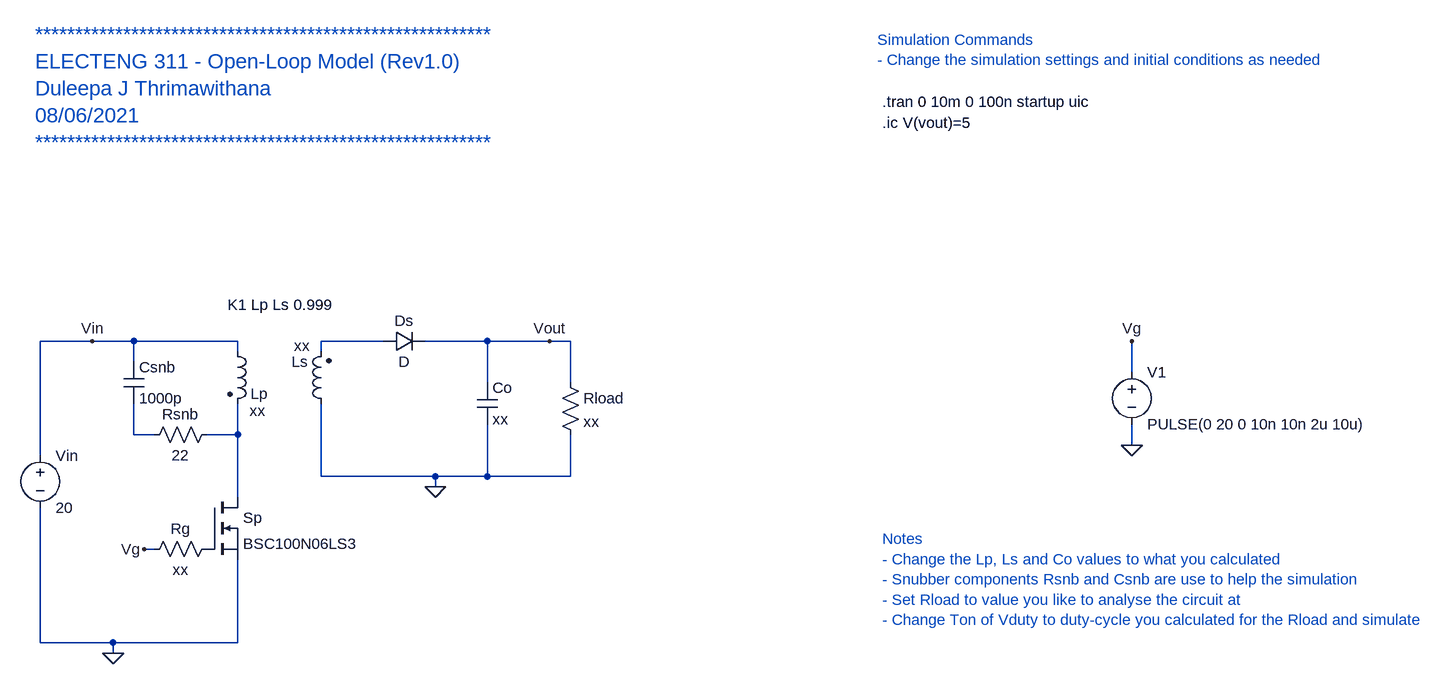
[diagram p0: schematic EE311_OpenLoop.asc]
EE311_OpenLoop.asc, the LTspice schematic file:
Version 4
SHEET 1 2708 1540
WIRE 192 48 112 48
WIRE 256 48 192 48
WIRE 416 48 256 48
WIRE 640 48 544 48
WIRE 800 48 704 48
WIRE 896 48 800 48
WIRE 928 48 896 48
WIRE 416 64 416 48
WIRE 544 64 544 48
WIRE 256 80 256 48
WIRE 1792 96 1792 48
WIRE 800 112 800 48
WIRE 928 112 928 48
WIRE 256 192 256 144
WIRE 288 192 256 192
WIRE 416 192 416 144
WIRE 416 192 368 192
WIRE 1792 208 1792 176
WIRE 112 224 112 48
WIRE 544 256 544 144
WIRE 720 256 544 256
WIRE 800 256 800 176
WIRE 800 256 720 256
WIRE 928 256 928 192
WIRE 928 256 800 256
WIRE 720 272 720 256
WIRE 416 288 416 192
WIRE 288 368 272 368
WIRE 112 512 112 304
WIRE 224 512 112 512
WIRE 416 512 416 384
WIRE 416 512 224 512
WIRE 224 528 224 512
FLAG 224 528 0
FLAG 720 272 0
FLAG 272 368 Vg
FLAG 192 48 Vin
FLAG 896 48 Vout
FLAG 1792 208 0
FLAG 1792 48 Vg
SYMBOL voltage 112 208 R0
SYMATTR InstName Vin
SYMATTR Value 20
SYMBOL ind2 400 48 R0
WINDOW 0 36 81 Left 2
WINDOW 3 34 107 Left 2
SYMATTR InstName Lp
SYMATTR Value xx
SYMATTR Type ind
SYMATTR SpiceLine Rser=0.01
SYMBOL ind2 560 160 R180
WINDOW 0 36 80 Left 2
WINDOW 3 33 105 Left 2
SYMATTR InstName Ls
SYMATTR Value xx
SYMATTR Type ind
SYMATTR SpiceLine Rser=0.01
SYMBOL nmos 368 288 R0
SYMATTR InstName Sp
SYMATTR Value BSC100N06LS3
SYMBOL diode 640 64 R270
WINDOW 0 32 32 VTop 2
WINDOW 3 0 32 VBottom 2
SYMATTR InstName Ds
SYMBOL cap 784 112 R0
SYMATTR InstName Co
SYMATTR Value xx
SYMATTR SpiceLine Rser=10m
SYMBOL res 912 96 R0
SYMATTR InstName Rload
SYMATTR Value xx
SYMBOL res 384 352 R90
WINDOW 0 0 56 VBottom 2
WINDOW 3 32 56 VTop 2
SYMATTR InstName Rg
SYMATTR Value xx
SYMBOL cap 240 80 R0
SYMATTR InstName Csnb
SYMATTR Value 1000p
SYMBOL res 384 176 R90
WINDOW 0 0 56 VBottom 2
WINDOW 3 32 56 VTop 2
SYMATTR InstName Rsnb
SYMATTR Value 22
SYMBOL voltage 1792 80 R0
WINDOW 123 0 0 Left 0
WINDOW 39 0 0 Left 0
SYMATTR InstName V1
SYMATTR Value PULSE(0 20 0 10n 10n 2u 10u)
TEXT 1408 -320 Left 2 !.tran 0 10m 0 100n startup uic
TEXT 400 -8 Left 2 !K1 Lp Ls 0.999
TEXT 1408 -288 Left 2 !.ic V(vout)=5
TEXT 104 -424 Left 3 ;*********************************************************\nELECTENG 311 - Open-Loop Model (Rev1.0)\nDuleepa J Thrimawithana\n08/06/2021\n*********************************************************
TEXT 1400 -416 Left 2 ;Simulation Commands\n- Change the simulation settings and initial conditions as needed
TEXT 1408 352 Left 2 ;Notes\n- Change the Lp, Ls and Co values to what you calculated\n- Snubber components Rsnb and Csnb are use to help the simulation\n- Set Rload to value you like to analyse the circuit at\n- Change Ton of Vduty to duty-cycle you calculated for the Rload and simulate

The netlist it stands for:
* EE311_OpenLoop.asc
Vin Vin 0 20
Lp Vin N003 xx Rser=0.01
Ls 0 N001 xx Rser=0.01
M§Sp N003 P001 0 0 BSC100N06LS3
Ds N001 Vout D
Co Vout 0 xx Rser=10m
Rload Vout 0 xx
Rg P001 Vg xx
Csnb Vin N002 1000p
Rsnb N003 N002 22
V1 Vg 0 PULSE(0 20 0 10n 10n 2u 10u)
.model D D
.lib standard.dio
.model NMOS NMOS
.model PMOS PMOS
.lib standard.mos
.tran 0 10m 0 100n startup uic
K1 Lp Ls 0.999
.ic V(vout)=5
* *********************************************************
* ELECTENG 311 - Open-Loop Model (Rev1.0)
* Duleepa J Thrimawithana
* 08/06/2021
* *********************************************************
* Simulation Commands
* - Change the simulation settings and initial conditions as needed
* Notes
* - Change the Lp, Ls and Co values to what you calculated
* - Snubber components Rsnb and Csnb are use to help the simulation
* - Set Rload to value you like to analyse the circuit at
* - Change Ton of Vduty to duty-cycle you calculated for the Rload and simulate
.backanno
.end